# Altium schematic sheet KeplerAdvancedVehicleInterface.SchDoc (part 1 of 2)
size A1
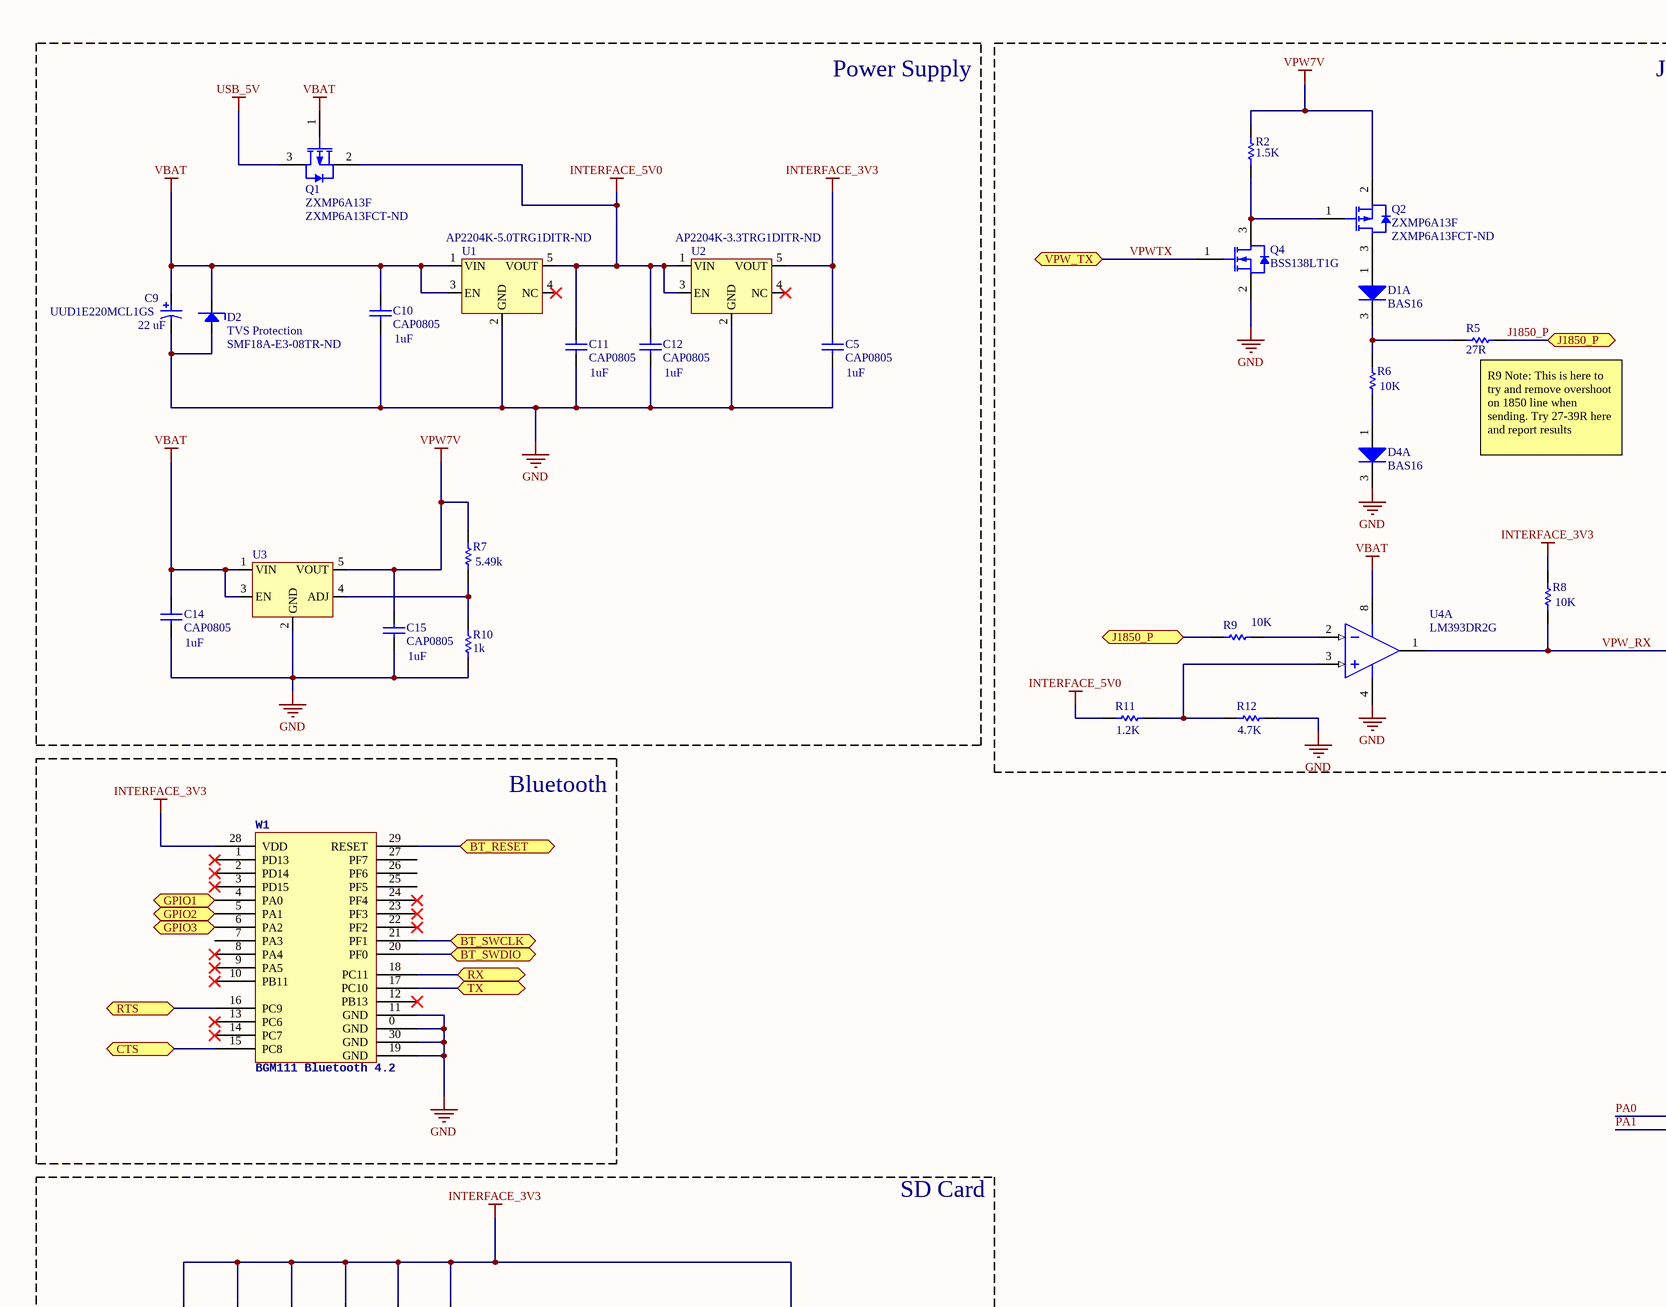
[diagram p0: KeplerAdvancedVehicleInterface.SchDoc, top left]
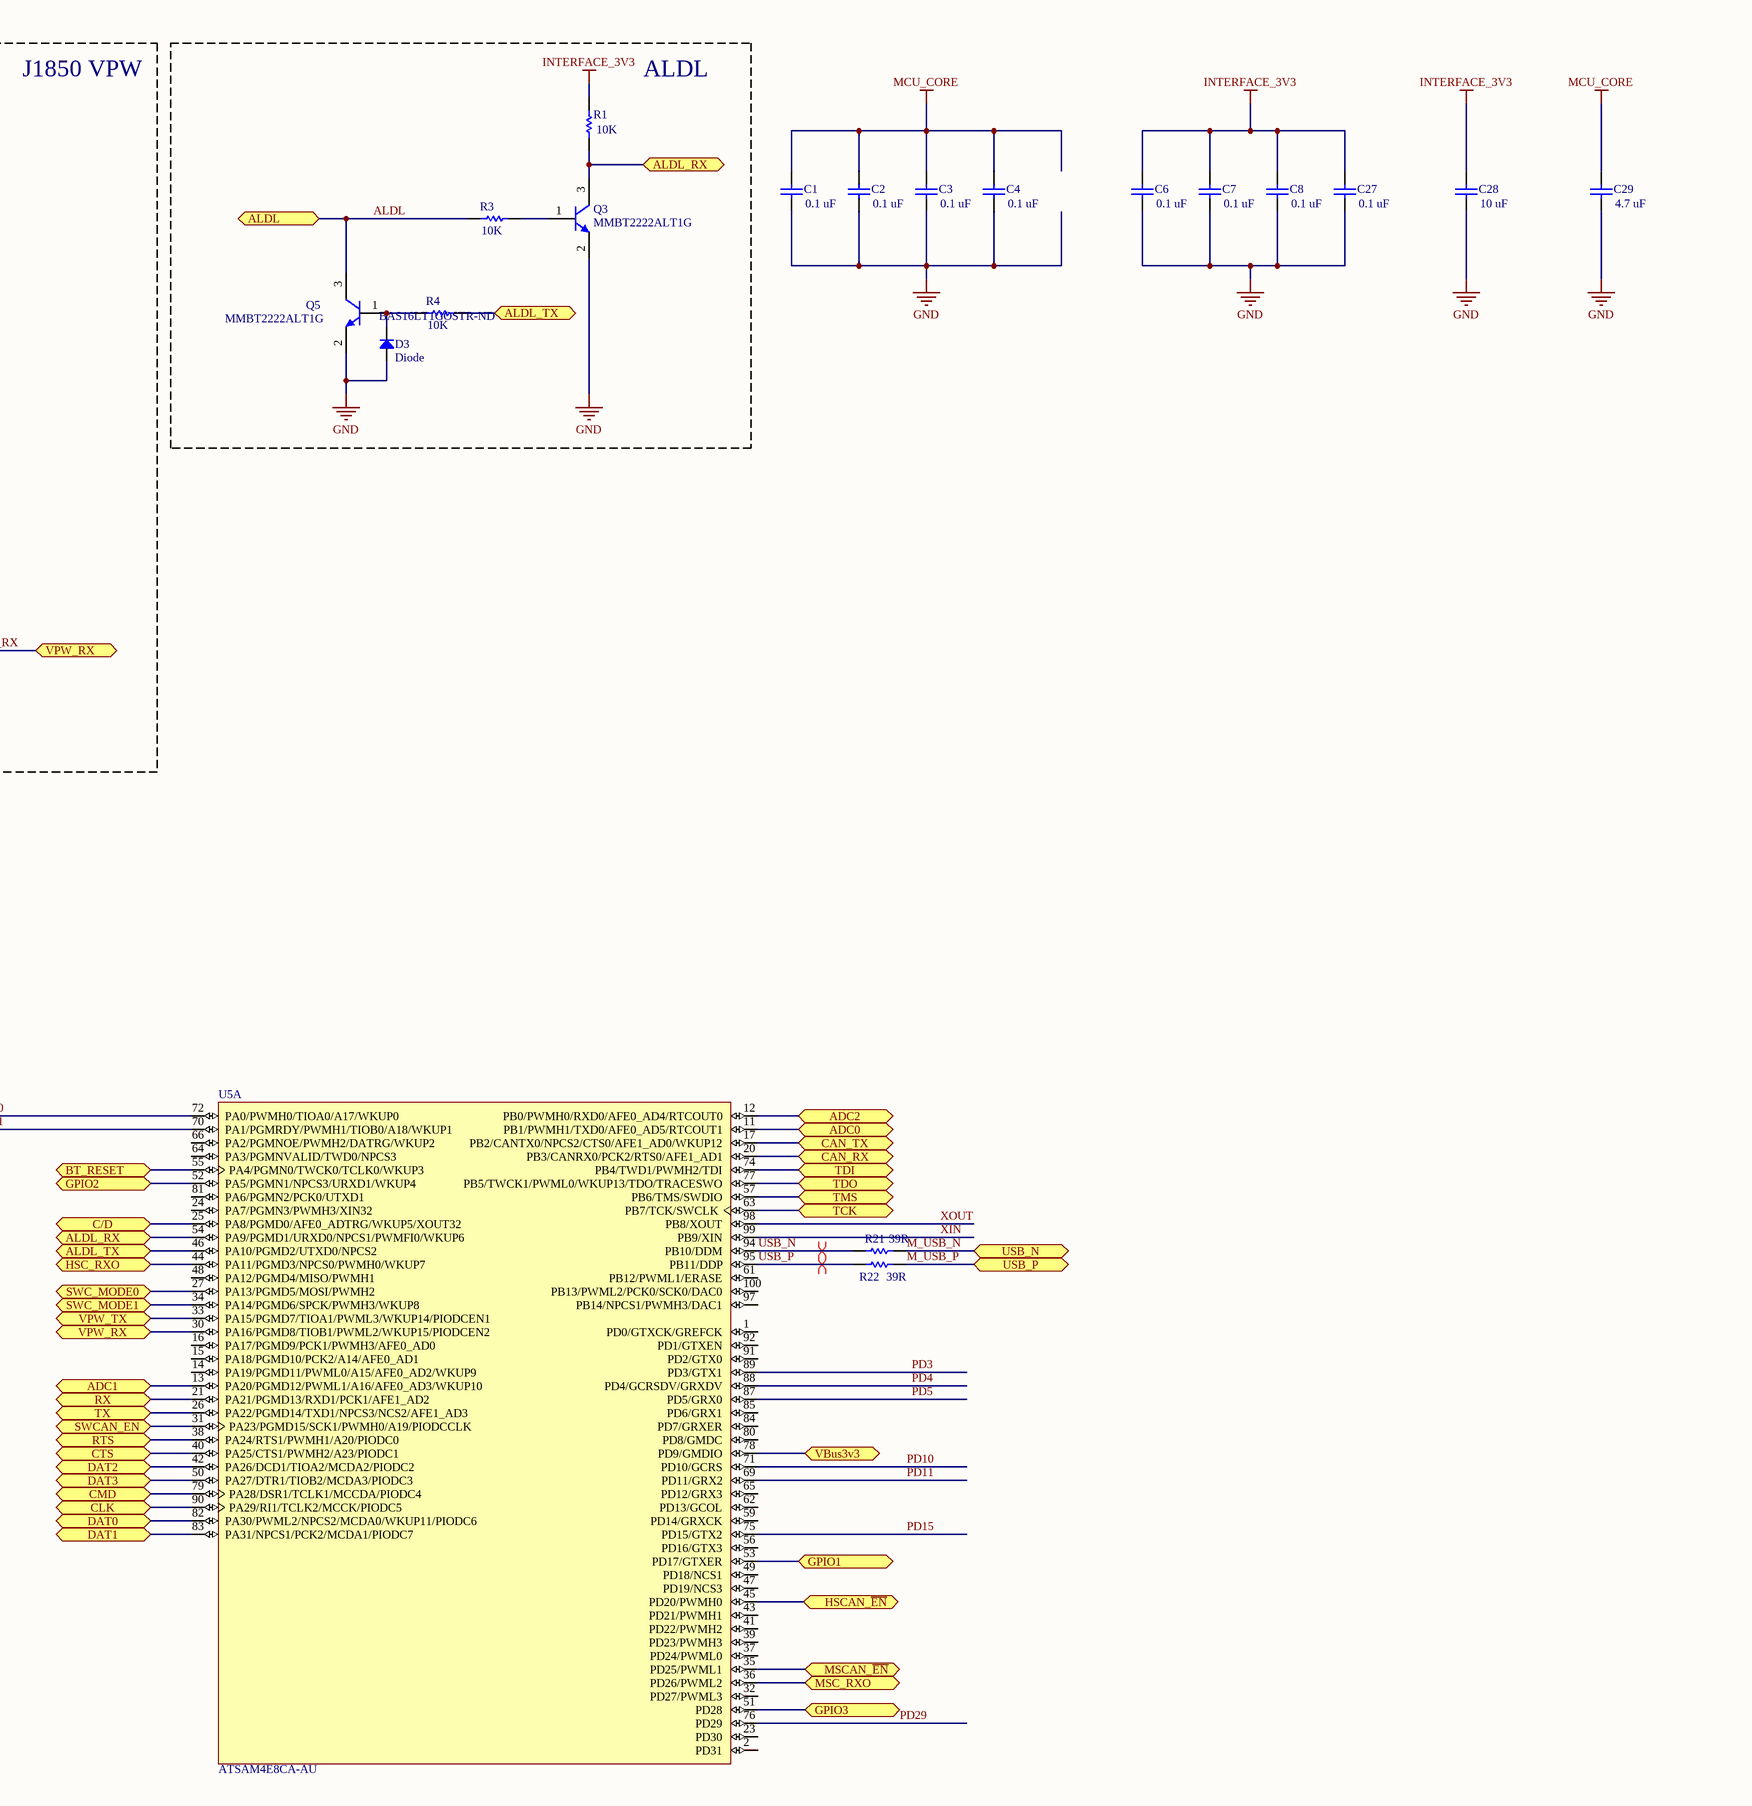
[diagram p1: KeplerAdvancedVehicleInterface.SchDoc, top right]
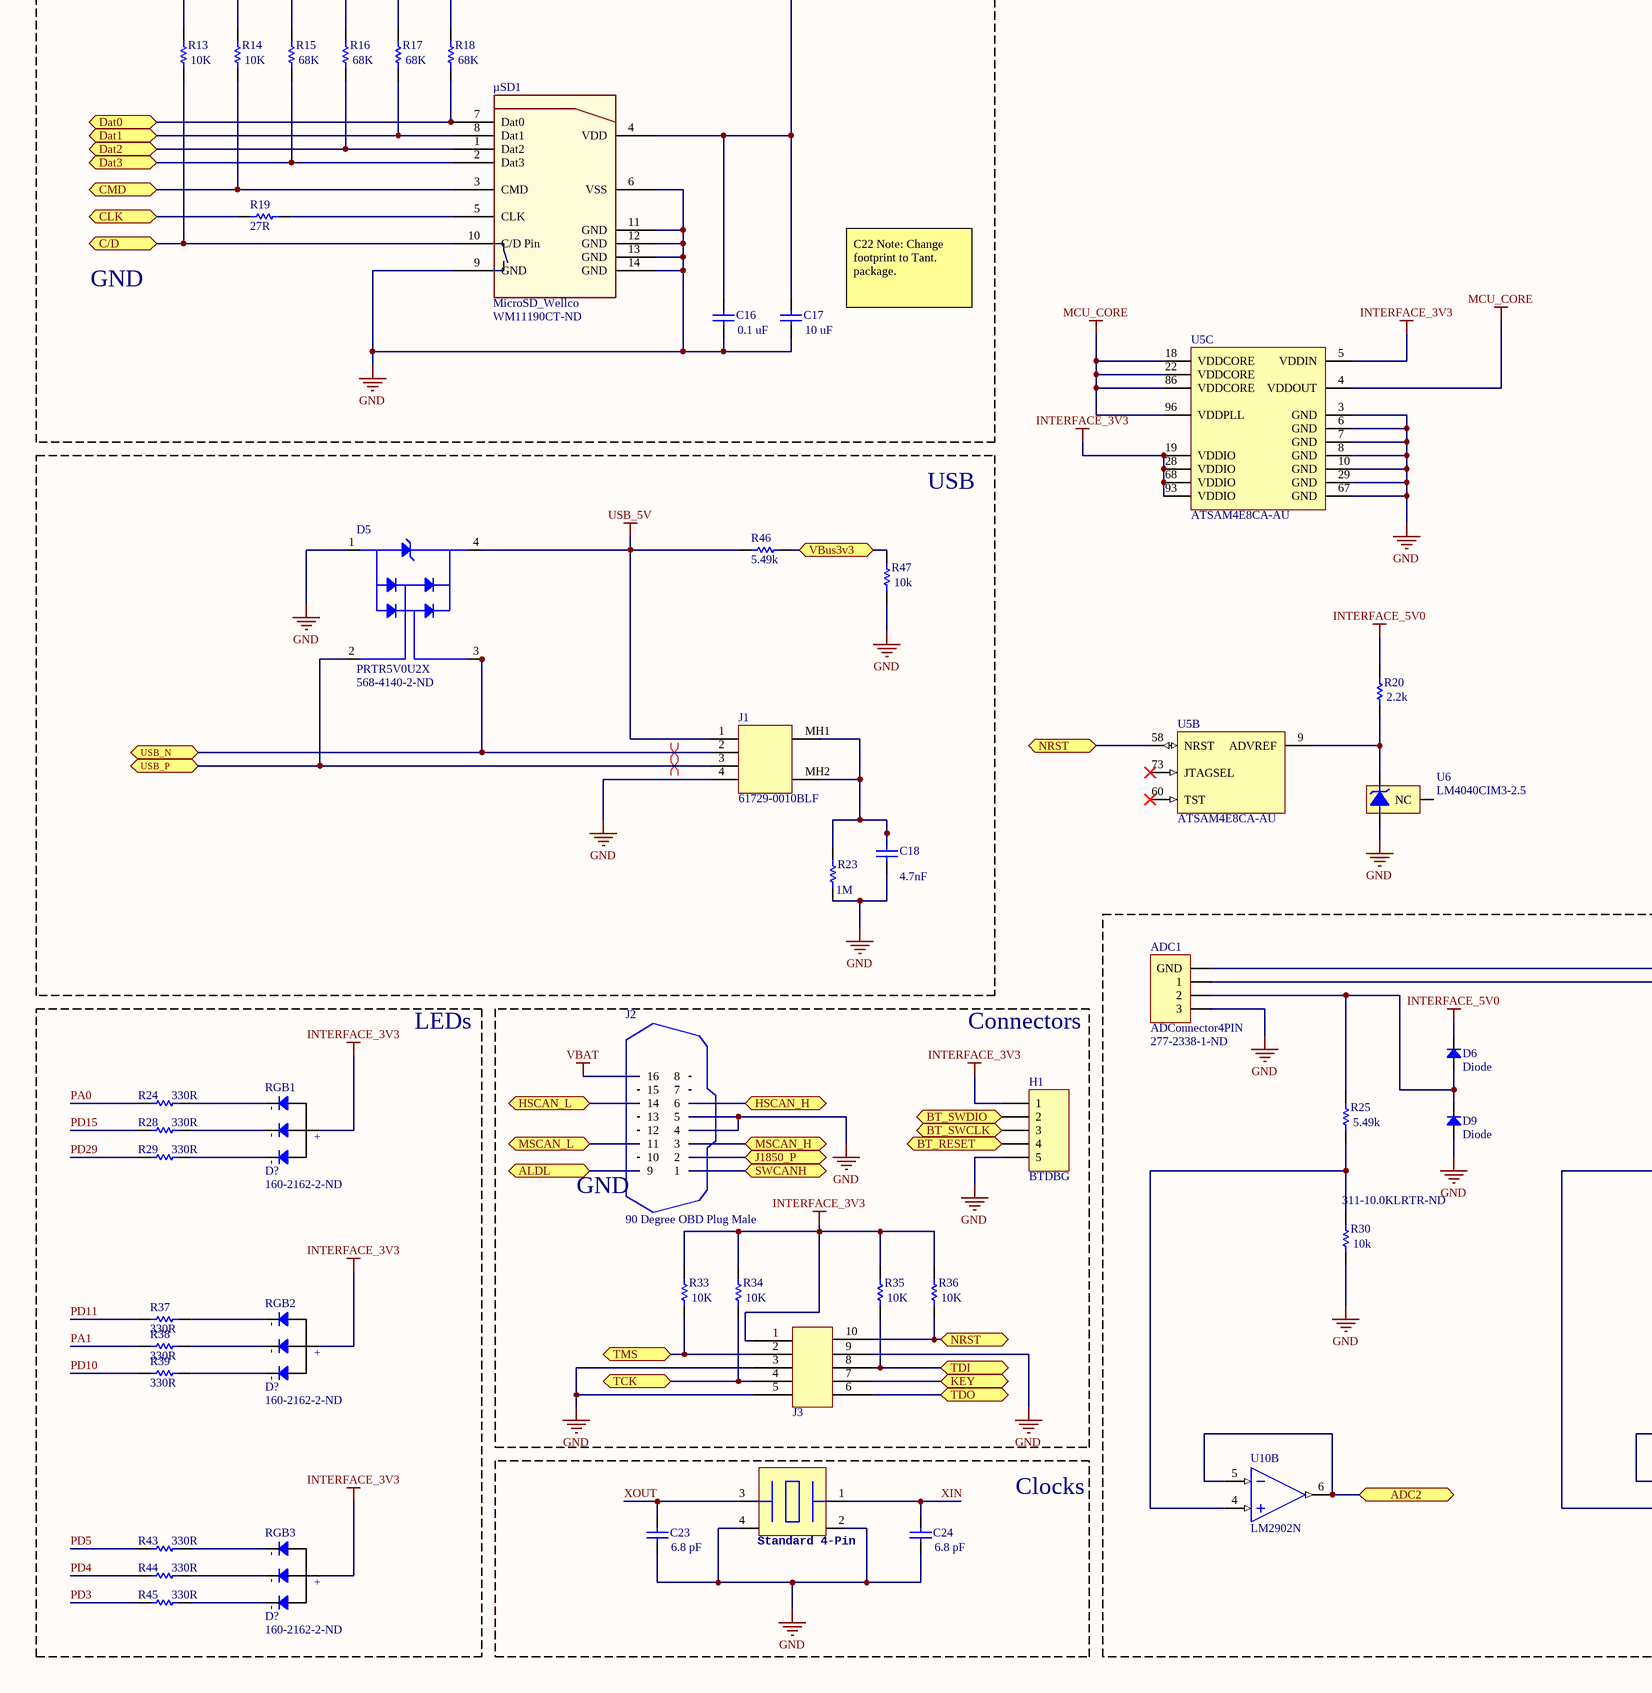
[diagram p2: KeplerAdvancedVehicleInterface.SchDoc, bottom left]
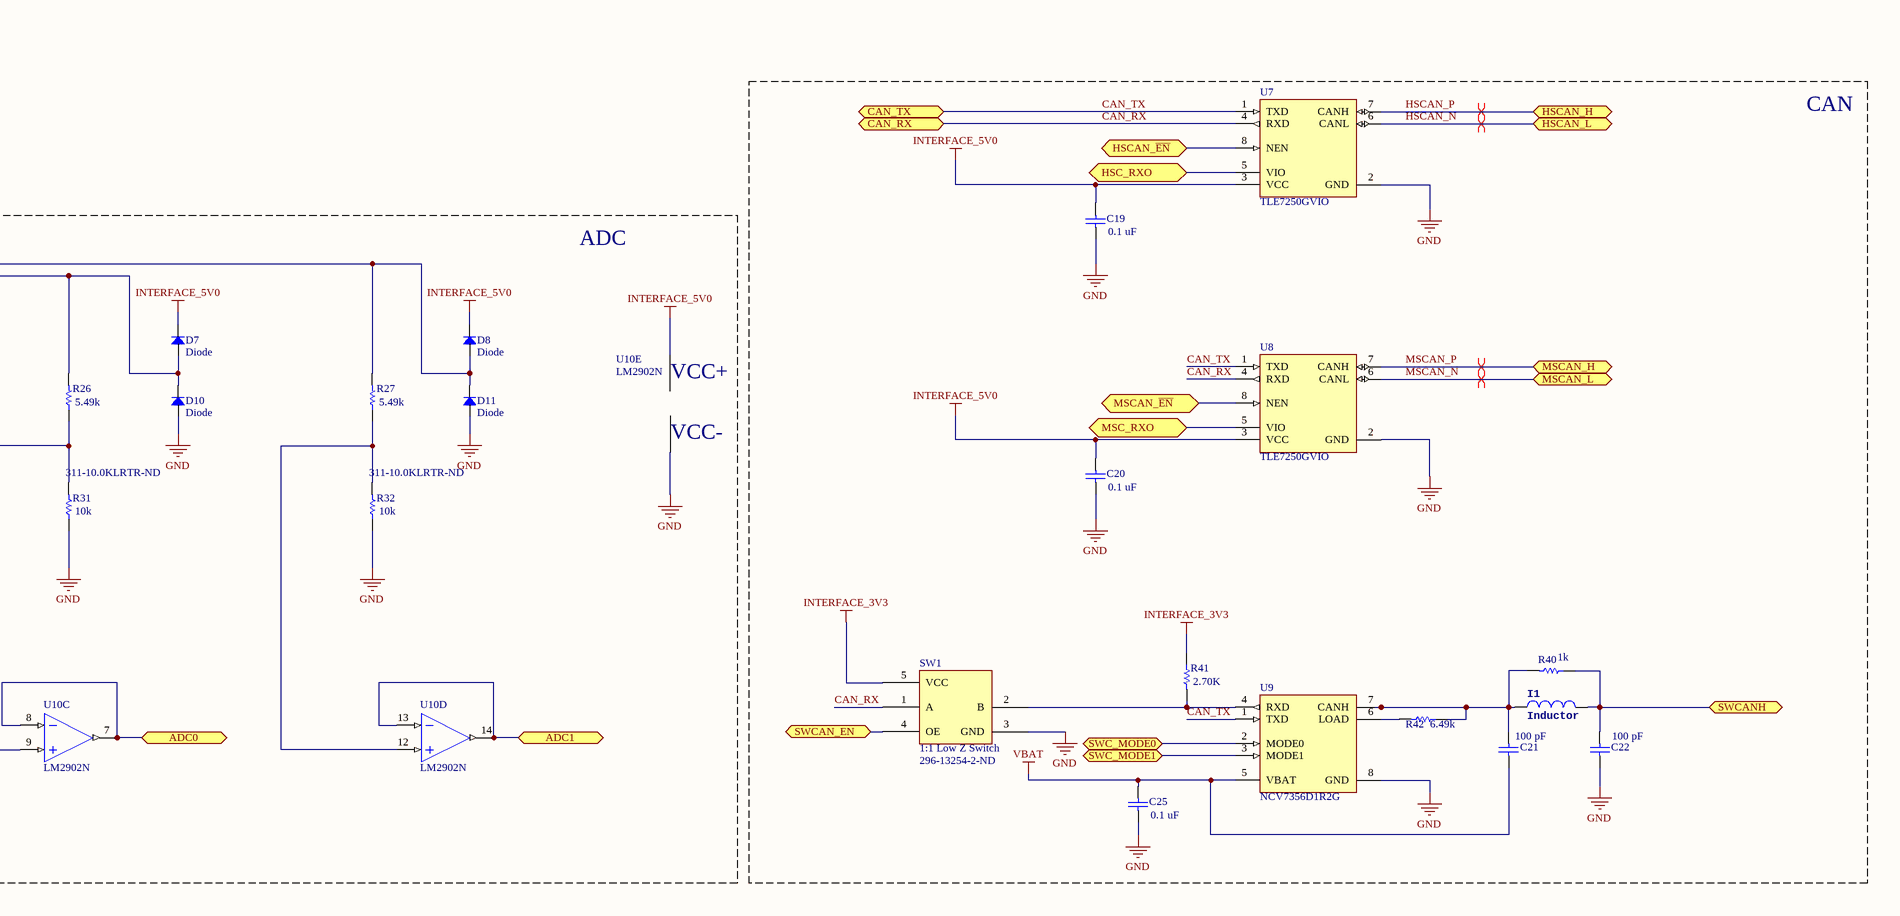
[diagram p3: KeplerAdvancedVehicleInterface.SchDoc, bottom right]

## Parts
(Parts that share a designator on the sheet are numbered #1, #2 ... from top to bottom, then left to right.)
ADC1  ADConnector4PIN  Supplier Part Number 1: 277-2338-1-ND  [PTSM 0,5/ 4-2,5-H SMD R24]
C1  value 0.1 uF  [CAPC0402(1005)60_L]  (hidden comment: CAP0402)
C2  value 0.1 uF  [CAPC0402(1005)60_L]  (hidden comment: CAP0402)
C3  value 0.1 uF  [CAPC0402(1005)60_L]  (hidden comment: CAP0402)
C4  value 0.1 uF  [CAPC0402(1005)60_L]  (hidden comment: CAP0402)
C5  CAP0805  value 1uF  [CAPC0805(2012)145_L]
C6  value 0.1 uF  [CAPC0402(1005)60_L]  (hidden comment: CAP0402)
C7  value 0.1 uF  [CAPC0402(1005)60_L]  (hidden comment: CAP0402)
C8  value 0.1 uF  [CAPC0402(1005)60_L]  (hidden comment: CAP0402)
C9  UUD1E220MCL1GS  Rated Capacitance: 22 uF  [NIC-CAPA2-5X5.8_V]
C10  CAP0805  value 1uF  [CAPC0805(2012)145_L]
C11  CAP0805  value 1uF  [CAPC0805(2012)145_L]
C12  CAP0805  value 1uF  [CAPC0805(2012)145_L]
C14  CAP0805  value 1uF  [CAPC0805(2012)145_L]
C15  CAP0805  value 1uF  [CAPC0805(2012)145_L]
C16  value 0.1 uF  [CAPC0402(1005)60_L]  (hidden comment: CAP0402)
C17  value 10 uF  [CAPC0805(2012)145_L]  (hidden comment: CAP0805)
C18  value 4.7nF  [CAPC0402(1005)60_L]  (hidden comment: CAP0402)
C19  value 0.1 uF  [CAPC0402(1005)60_L]  (hidden comment: CAP0402)
C20  value 0.1 uF  [CAPC0402(1005)60_L]  (hidden comment: CAP0402)
C21  value 100 pF  [CAPC0603(1608)100_L]  (hidden comment: CAP0603)
C22  value 100 pF  [CAPC0603(1608)100_L]  (hidden comment: CAP0603)
C23  value 6.8 pF  [CAPC0402(1005)60_L]  (hidden comment: CAP0402)
C24  value 6.8 pF  [CAPC0402(1005)60_L]  (hidden comment: CAP0402)
C25  value 0.1 uF  [CAPC0402(1005)60_L]  (hidden comment: CAP0402)
C27  value 0.1 uF  [CAPC0402(1005)60_L]  (hidden comment: CAP0402)
C28  value 10 uF  [CAPC0805(2012)145_L]  (hidden comment: CAP0805)
C29  value 4.7 uF  [CAPC1206(3216)150_L]  (hidden comment: CAP1206)
D1  BAS16  [NXP-SOT23-3_V]  (part A of 2)
D2  TVS Protection  Supplier Part Number 1: SMF18A-E3-08TR-ND  [SODFL370X108-2N]
D3  Diode  Supplier Part Number 1: BAS16LT1GOSTR-ND  [SOT23]
D4  BAS16  [NXP-SOT23-3_V]  (part A of 2)
D5  PRTR5V0U2X  Supplier Part Number 1: 568-4140-2-ND  [SOT143]
D6  Diode  [SOT23]
D7  Diode  [SOT23]
D8  Diode  [SOT23]
D9  Diode  [SOT23]
D10  Diode  [SOT23]
D11  Diode  [SOT23]
H1  BTDBG  [HDR1X5]  (no BOM)
I1  Inductor  [L0805]
J1  61729-0010BLF  [FCI-61729-0010BLF-6_V]
J2  90 Degree OBD Plug Male  [90-Deg-OBD-Plug]
J3  5x10  [CON10_2X5]  (value not drawn)  (no BOM)
Q1  ZXMP6A13F  Supplier Part Number 1: ZXMP6A13FCT-ND  [SOT23]
Q2  ZXMP6A13F  Supplier Part Number 1: ZXMP6A13FCT-ND  [SOT23]
Q3  MMBT2222ALT1G  [ONSC-SOT-23-3-318-08_V]
Q4  BSS138LT1G  [ONSC-SOT-23-3-318-08_V]
Q5  MMBT2222ALT1G  [ONSC-SOT-23-3-318-08_V]
R1  value 10K  [RESC0402(1005)_L]  (hidden comment: RES0402)
R2  value 1.5K  [RESC0402(1005)_L]  (hidden comment: RES0402)
R3  value 10K  [RESC0402(1005)_L]  (hidden comment: RES0402)
R4  value 10K  [RESC0402(1005)_L]  (hidden comment: RES0402)
R5  value 27R  [RESC0402(1005)_L]  (hidden comment: RES0402)
R6  value 10K  [RESC0402(1005)_L]  (hidden comment: RES0402)
R7  value 5.49k  [RESC0402(1005)_L]  (hidden comment: RES0402)
R8  value 10K  [RESC0402(1005)_L]  (hidden comment: RES0402)
R9  value 10K  [RESC0402(1005)_L]  (hidden comment: RES0402)
R10  value 1k  [RESC0402(1005)_L]  (hidden comment: RES0402)
R11  value 1.2K  [RESC0402(1005)_L]  (hidden comment: RES0402)
R12  value 4.7K  [RESC0402(1005)_L]  (hidden comment: RES0402)
R13  value 10K  [RESC0402(1005)_L]  (hidden comment: RES0402)
R14  value 10K  [RESC0402(1005)_L]  (hidden comment: RES0402)
R15  value 68K  [RESC0402(1005)_L]  (hidden comment: RES0402)
R16  value 68K  [RESC0402(1005)_L]  (hidden comment: RES0402)
R17  value 68K  [RESC0402(1005)_L]  (hidden comment: RES0402)
R18  value 68K  [RESC0402(1005)_L]  (hidden comment: RES0402)
R19  value 27R  [RESC0402(1005)_L]  (hidden comment: RES0402)
R20  value 2.2k  [RESC0402(1005)_L]  (hidden comment: RES0402)
R21  value 39R  [RESC0402(1005)_L]  (hidden comment: RES0402)
R22  value 39R  [RESC0402(1005)_L]  (hidden comment: RES0402)
R23  value 1M  [RESC0402(1005)_L]  (hidden comment: RES0402)
R24  value 330R  [RESC0402(1005)_L]  (hidden comment: RES0402)
R25  value 5.49k  [RESC0402(1005)_L]  (hidden comment: RES0402)
R26  value 5.49k  [RESC0402(1005)_L]  (hidden comment: RES0402)
R27  value 5.49k  [RESC0402(1005)_L]  (hidden comment: RES0402)
R28  value 330R  [RESC0402(1005)_L]  (hidden comment: RES0402)
R29  value 330R  [RESC0402(1005)_L]  (hidden comment: RES0402)
R30  value 10k  Supplier Part Number 1: 311-10.0KLRTR-ND  [RESC0402(1005)_L]  (hidden comment: RES0402)
R31  value 10k  Supplier Part Number 1: 311-10.0KLRTR-ND  [RESC0402(1005)_L]  (hidden comment: RES0402)
R32  value 10k  Supplier Part Number 1: 311-10.0KLRTR-ND  [RESC0402(1005)_L]  (hidden comment: RES0402)
R33  value 10K  [RESC0402(1005)_L]  (hidden comment: RES0402)
R34  value 10K  [RESC0402(1005)_L]  (hidden comment: RES0402)
R35  value 10K  [RESC0402(1005)_L]  (hidden comment: RES0402)
R36  value 10K  [RESC0402(1005)_L]  (hidden comment: RES0402)
R37  value 330R  [RESC0402(1005)_L]  (hidden comment: RES0402)
R38  value 330R  [RESC0402(1005)_L]  (hidden comment: RES0402)
R39  value 330R  [RESC0402(1005)_L]  (hidden comment: RES0402)
R40  value 1k  [RESC0402(1005)_L]  (hidden comment: RES0402)
R41  value 2.70K  [RESC0402(1005)_L]  (hidden comment: RES0402)
R42  value 6.49k  [RESC0402(1005)_L]  (hidden comment: RES0402)
R43  value 330R  [RESC0402(1005)_L]  (hidden comment: RES0402)
R44  value 330R  [RESC0402(1005)_L]  (hidden comment: RES0402)
R45  value 330R  [RESC0402(1005)_L]  (hidden comment: RES0402)
R46  value 5.49k  [RESC0402(1005)_L]  (hidden comment: RES0402)
R47  value 10k  [RESC0402(1005)_L]  (hidden comment: RES0402)
RGB1  D?  Supplier Part Number 1: 160-2162-2-ND  [RGBLED W/ LIGHTPIPE]
RGB2  D?  Supplier Part Number 1: 160-2162-2-ND  [RGBLED W/ LIGHTPIPE]
RGB3  D?  Supplier Part Number 1: 160-2162-2-ND  [RGBLED W/ LIGHTPIPE]
SW1  1:1 Low Z Switch  Supplier Part Number 1: 296-13254-2-ND  [SC70-switch]
U1  Supplier Part Number 1: AP2204K-5.0TRG1DITR-ND  [SOT95P284X130-5N]  (hidden comment: U?)
U2  Supplier Part Number 1: AP2204K-3.3TRG1DITR-ND  [SOT95P284X130-5N]  (hidden comment: U?)
U3  (no value)  [SOT95P284X130-5N]
U4  LM393DR2G  [ONSC-SOIC-8-751-07_V]  (part A of 2)
U5#1  ATSAM4E8CA-AU  [LQFP100_N]  (part A of 3)
U5#2  ATSAM4E8CA-AU  [LQFP100_N]  (parts B,C of 3)
U6  LM4040CIM3-2.5  [DBZ0003A_N]
U7  TLE7250GVIO  [INF-PG-DSO-8-16_L]
U8  TLE7250GVIO  [INF-PG-DSO-8-16_L]
U9  NCV7356D1R2G  [ONSC-SOIC-8-751-07_V]
U10  LM2902N  [QFN50P300X300X100_HS-17N]  (parts B,C,D,E of 5)
W1  BGM111 Bluetooth 4.2  [BGM111]
XC1  Standard 4-Pin  [DFN240P320X110-4N]
µSD1  MicroSD_Wellco  Supplier Part Number 1: WM11190CT-ND  [MicroSD_Molex]

## Blocks framed on the sheet
Power Supply: C5 C9-C12 C14 C15 D2 Q1 R7 R10 U1-U3
J1850 VPW: D1 D4 Q2 Q4 R2 R5 R6 R8 R9 R11 R12 U4
ALDL: D3 Q3 Q5 R1 R3 R4
Bluetooth: W1
USB: C18 D5 J1 R23 R46 R47
CAN: C19-C22 C25 I1 R40-R42 SW1 U7-U9
ADC: ADC1 D6-D11 R25-R27 R30-R32 U10
LEDs: R24 R28 R29 R37-R39 R43-R45 RGB1-RGB3
Clocks: C23 C24 XC1

## Ports
ADC0, ADC1, ADC2, ALDL, ALDL_RX, ALDL_TX, BT_RESET, BT_SWCLK, BT_SWDIO, C/D, CAN_RX, CAN_TX, CLK, CMD, CTS, Dat0, DAT0, Dat1, DAT1, Dat2, DAT2, Dat3, DAT3, GPIO1, GPIO2, GPIO3, HSC_RXO, HSCAN_H, HSCAN_L, HSCAN_~{EN}, J1850_P, KEY, MSC_RXO, MSCAN_H, MSCAN_L, MSCAN_~{EN}, NRST, RTS, RX, SWC_MODE0, SWC_MODE1, SWCAN_EN, SWCANH, TCK, TDI, TDO, TMS, TX, USB_N, USB_N (bidir), USB_P, USB_P (bidir), VBus3v3, VPW_RX, VPW_TX

## Nets
GND: ADC1.4(3) C1.1 C2.1 C3.1 C4.1 C5.1 C6.1 C7.1 C8.1 C9.2 C10.1 C11.1 C12.1 C14.1 C15.1 C16.1 C17.1 C18.1 C19.2 C20.2 C22.1 C23.1 C24.1 C25.1 C27.1 C28.1 C29.1 D2.1 D3.1 D4.3(K) D5.1 D9.1 D10.1 D11.1 H1.5 J1.4 J2.4 J2.5 J3.3 J3.5 J3.9 Q3.2(E) Q4.2(S) Q5.2(E) R10.2 R12.1 R23.1 R30.1 R31.1 R32.1 R47.1 SW1.3(GND) U1.2(GND) U2.2(GND) U3.2(GND) U4.4(GND) U5#2.3(GND) U5#2.6(GND) U5#2.7(GND) U5#2.8(GND) U5#2.10(GND) U5#2.29(GND) U5#2.67(GND) U6.2(-V) U7.2(GND) U8.2(GND) U9.8(GND) U10.11(VCC-) W1.0(GND) W1.11(GND) W1.19(GND) W1.30(GND) XC1.2 XC1.4 µSD1.6(VSS) µSD1.9(GND) µSD1.11(GND) µSD1.12(GND) µSD1.13(GND) µSD1.14(GND)
INTERFACE_3V3: C5.2 C6.2 C7.2 C8.2 C16.2 C17.2 C27.2 C28.2 H1.1 J3.1 R1.2 R8.1 R13.2 R14.2 R15.2 R16.2 R17.2 R18.2 R33.2 R34.2 R35.2 R36.2 R41.1 RGB1.4 RGB2.4 RGB3.4 SW1.5(VCC) U2.5(VOUT) U5#2.5(VDDIN) U5#2.19(VDDIO) U5#2.28(VDDIO) U5#2.68(VDDIO) U5#2.93(VDDIO) W1.28(VDD) µSD1.4(VDD)
INTERFACE_5V0: C11.2 C12.2 C19.1 C20.1 D6.3 D7.3 D8.3 Q1.2(S) R11.2 R20.2 U1.5(VOUT) U2.1(VIN) U2.3(EN) U7.3(VCC) U8.3(VCC) U10.2(VCC+)
MCU_CORE: C1.2 C2.2 C3.2 C4.2 C29.2 U5#2.4(VDDOUT) U5#2.18(VDDCORE) U5#2.22(VDDCORE) U5#2.86(VDDCORE) U5#2.96(VDDPLL)
USB_5V: D5.4 J1.1 Q1.3(D) R46.2
VBAT: C9.1 C10.2 C14.2 C21.1 C25.2 D2.2 J2.16 Q1.1(G) U1.1(VIN) U1.3(EN) U3.1(VIN) U3.3(EN) U4.8(VCC) U9.5(VBAT)
VPW7V: C15.2 Q2.2(S) R2.2 R7.2 U3.5(VOUT)
ADC0: U5#1.11(PB1/PWMH1/TXD0/AFE0_AD5/RTCOUT1) U10.7(OUT3) U10.8(IN3-) ; port ADC0
ADC1: U5#1.13(PA20/PGMD12/PWML1/A16/AFE0_AD3/WKUP10) U10.13(IN4-) U10.14(OUT4) ; port ADC1
ADC2: U5#1.12(PB0/PWMH0/RXD0/AFE0_AD4/RTCOUT0) U10.5(IN2-) U10.6(OUT2) ; port ADC2
ALDL: J2.9 Q5.3(C) R3.1 ; port ALDL
ALDL_RX: Q3.3(C) R1.1 U5#1.54(PA9/PGMD1/URXD0/NPCS1/PWMFI0/WKUP6) ; port ALDL_RX
ALDL_TX: R4.2 U5#1.46(PA10/PGMD2/UTXD0/NPCS2) ; port ALDL_TX
BT_RESET: H1.4 U5#1.55(PA4/PGMN0/TWCK0/TCLK0/WKUP3) W1.29(RESET) ; port BT_RESET
BT_SWCLK: H1.3 W1.21(PF1) ; port BT_SWCLK
BT_SWDIO: H1.2 W1.20(PF0) ; port BT_SWDIO
C/D: R13.1 U5#1.25(PA8/PGMD0/AFE0_ADTRG/WKUP5/XOUT32) µSD1.10(C/D_Pin) ; port C/D
CAN_RX: SW1.1(A) U5#1.20(PB3/CANRX0/PCK2/RTS0/AFE1_AD1) U7.4(RXD) U8.4(RXD) ; port CAN_RX
CAN_TX: U5#1.17(PB2/CANTX0/NPCS2/CTS0/AFE1_AD0/WKUP12) U7.1(TXD) U8.1(TXD) U9.1(TXD) ; port CAN_TX
CLK: R19.2 U5#1.90(PA29/RI1/TCLK2/MCCK/PIODC5) ; port CLK
CMD: R14.1 U5#1.79(PA28/DSR1/TCLK1/MCCDA/PIODC4) µSD1.3(CMD) ; port CMD
CTS: U5#1.40(PA25/CTS1/PWMH2/A23/PIODC1) W1.15(PC8) ; port CTS
Dat0: R18.1 U5#1.82(PA30/PWML2/NPCS2/MCDA0/WKUP11/PIODC6) µSD1.7(Dat0) ; port Dat0, port DAT0
Dat1: R17.1 U5#1.83(PA31/NPCS1/PCK2/MCDA1/PIODC7) µSD1.8(Dat1) ; port Dat1, port DAT1
Dat2: R16.1 U5#1.42(PA26/DCD1/TIOA2/MCDA2/PIODC2) µSD1.1(Dat2) ; port Dat2, port DAT2
Dat3: R15.1 U5#1.50(PA27/DTR1/TIOB2/MCDA3/PIODC3) µSD1.2(Dat3) ; port Dat3, port DAT3
GPIO1: U5#1.53(PD17/GTXER) W1.4(PA0) ; port GPIO1
GPIO2: U5#1.52(PA5/PGMN1/NPCS3/URXD1/WKUP4) W1.5(PA1) ; port GPIO2
GPIO3: U5#1.51(PD28) W1.6(PA2) ; port GPIO3
HSC_RXO: U5#1.44(PA11/PGMD3/NPCS0/PWMH0/WKUP7) U7.5(VIO) ; port HSC_RXO
HSCAN_~{EN}: U5#1.45(PD20/PWMH0) U7.8(NEN) ; port HSCAN_~{EN}
HSCAN_N: J2.14 U7.6(CANL) ; port HSCAN_L
HSCAN_P: J2.6 U7.7(CANH) ; port HSCAN_H
J1850_P: J2.2 R5.1 R9.2 ; port J1850_P
KEY: J3.7 ; port KEY
M_USB_N: D5.3 J1.2 R21.2 ; port USB_N
M_USB_P: D5.2 J1.3 R22.2 ; port USB_P
MSC_RXO: U5#1.36(PD26/PWML2) U8.5(VIO) ; port MSC_RXO
MSCAN_~{EN}: U5#1.35(PD25/PWML1) U8.8(NEN) ; port MSCAN_~{EN}
MSCAN_N: J2.11 U8.6(CANL) ; port MSCAN_L
MSCAN_P: J2.3 U8.7(CANH) ; port MSCAN_H
NRST: J3.10 R36.1 U5#2.58(NRST) ; port NRST
PA0: R24.1 U5#1.72(PA0/PWMH0/TIOA0/A17/WKUP0)
PA1: R38.1 U5#1.70(PA1/PGMRDY/PWMH1/TIOB0/A18/WKUP1)
PD3: R45.1 U5#1.89(PD3/GTX1)
PD4: R44.1 U5#1.88(PD4/GCRSDV/GRXDV)
PD5: R43.1 U5#1.87(PD5/GRX0)
PD10: R39.1 U5#1.71(PD10/GCRS)
PD11: R37.1 U5#1.69(PD11/GRX2)
PD15: R28.1 U5#1.75(PD15/GTX2)
PD29: R29.1 U5#1.76(PD29)
RTS: U5#1.38(PA24/RTS1/PWMH1/A20/PIODC0) W1.16(PC9) ; port RTS
RX: U5#1.21(PA21/PGMD13/RXD1/PCK1/AFE1_AD2) W1.18(PC11) ; port RX
SWC_MODE0: U5#1.27(PA13/PGMD5/MOSI/PWMH2) U9.2(MODE0) ; port SWC_MODE0
SWC_MODE1: U5#1.34(PA14/PGMD6/SPCK/PWMH3/WKUP8) U9.3(MODE1) ; port SWC_MODE1
SWCAN_EN: SW1.4(OE) U5#1.31(PA23/PGMD15/SCK1/PWMH0/A19/PIODCCLK) ; port SWCAN_EN
SWCANH: C22.2 I1.2 J2.1 R40.1 ; port SWCANH
TCK: J3.4 R34.1 U5#1.63(PB7/TCK/SWCLK) ; port TCK
TDI: J3.8 R35.1 U5#1.74(PB4/TWD1/PWMH2/TDI) ; port TDI
TDO: J3.6 U5#1.77(PB5/TWCK1/PWML0/WKUP13/TDO/TRACESWO) ; port TDO
TMS: J3.2 R33.1 U5#1.57(PB6/TMS/SWDIO) ; port TMS
TX: U5#1.26(PA22/PGMD14/TXD1/NPCS3/NCS2/AFE1_AD3) W1.17(PC10) ; port TX
USB_N: R21.1 U5#1.94(PB10/DDM)
USB_P: R22.1 U5#1.95(PB11/DDP)
VBus3v3: R46.1 R47.2 U5#1.78(PD9/GMDIO) ; port VBus3v3
VPW_RX: R8.2 U4.1(OUTA) U5#1.30(PA16/PGMD8/TIOB1/PWML2/WKUP15/PIODCEN2) ; port VPW_RX
VPWTX: Q4.1(G) U5#1.33(PA15/PGMD7/TIOA1/PWML3/WKUP14/PIODCEN1) ; port VPW_TX
XIN: C24.2 U5#1.99(PB9/XIN) XC1.1
XOUT: C23.2 U5#1.98(PB8/XOUT) XC1.3
NetADC1_1: ADC1.1(GND) D8.1 D11.3 R27.2
NetADC1_2: ADC1.2(1) D7.1 D10.3 R26.2
NetADC1_3: ADC1.3(2) D6.1 D9.3 R25.2
NetC18_2: C18.2 J1.MH1 J1.MH2 R23.2
NetC21_2: C21.2 I1.1 R40.2 R42.1 U9.7(CANH)
NetD1_1: D1.1(A) Q2.3(D)
NetD1_3: D1.3(K) R5.2 R6.2
NetD3_3: D3.3 Q5.1(B) R4.1
NetD4_1: D4.1(A) R6.1
NetQ2_1: Q2.1(G) Q4.3(D) R2.1
NetQ3_1: Q3.1(B) R3.2
NetR7_1: R7.1 R10.1 U3.4(ADJ)
NetR9_1: R9.1 U4.2(INA-)
NetR11_1: R11.1 R12.2 U4.3(INA+)
NetR19_1: R19.1 µSD1.5(CLK)
NetR20_1: R20.1 U5#2.9(ADVREF) U6.1(+V)
NetR24_2: R24.2 RGB1.1
NetR25_1: R25.1 R30.2 U10.4(IN2+)
NetR26_1: R26.1 R31.2 U10.9(IN3+)
NetR27_1: R27.1 R32.2 U10.12(IN4+)
NetR28_2: R28.2 RGB1.2
NetR29_2: R29.2 RGB1.3
NetR37_2: R37.2 RGB2.1
NetR38_2: R38.2 RGB2.2
NetR39_2: R39.2 RGB2.3
NetR41_2: R41.2 SW1.2(B) U9.4(RXD)
NetR42_2: R42.2 U9.6(LOAD)
NetR43_2: R43.2 RGB3.1
NetR44_2: R44.2 RGB3.2
NetR45_2: R45.2 RGB3.3

Not connected (* = marked no-connect by the designer): J2 7 8 10 12 13 15; U1 4(NC)*; U2 4(NC)*; U5#1 1(PD0/GTXCK/GREFCK) 2(PD31) 14(PA19/PGMD11/PWML0/A15/AFE0_AD2/WKUP9) 15(PA18/PGMD10/PCK2/A14/AFE0_AD1) 16(PA17/PGMD9/PCK1/PWMH3/AFE0_AD0) 23(PD30) 24(PA7/PGMN3/PWMH3/XIN32) 32(PD27/PWML3) 37(PD24/PWML0) 39(PD23/PWMH3) 41(PD22/PWMH2) 43(PD21/PWMH1) 47(PD19/NCS3) 48(PA12/PGMD4/MISO/PWMH1) 49(PD18/NCS1) 56(PD16/GTX3) 59(PD14/GRXCK) 61(PB12/PWML1/ERASE) 62(PD13/GCOL) 64(PA3/PGMNVALID/TWD0/NPCS3) 65(PD12/GRX3) 66(PA2/PGMNOE/PWMH2/DATRG/WKUP2) 80(PD8/GMDC) 81(PA6/PGMN2/PCK0/UTXD1) 84(PD7/GRXER) 85(PD6/GRX1) 91(PD2/GTX0) 92(PD1/GTXEN) 97(PB14/NPCS1/PWMH3/DAC1) 100(PB13/PWML2/PCK0/SCK0/DAC0); U5#2 60(TST)* 73(JTAGSEL)*; U6 3(NC); W1 1(PD13)* 2(PD14)* 3(PD15)* 7(PA3) 8(PA4)* 9(PA5)* 10(PB11)* 12(PB13)* 13(PC6)* 14(PC7)* 22(PF2)* 23(PF3)* 24(PF4)* 25(PF5) 26(PF6) 27(PF7)

## Layout directives
differential pair: HSCAN_N, HSCAN_P, M_USB_N, M_USB_P, MSCAN_N, MSCAN_P, USB_N, USB_P

## Notes on the sheet
- (near R5) R9 Note: This is here to try and remove overshoot on 1850 line when sending. Try 27-39R here and report results
- SD Card
- GND
- C22 Note: Change footprint to Tant. package.
- Connectors
- (near J2) GND
- (in symbol RGB_LED) -; +